# Altium schematic sheet BUS_LCD.SchDoc
size A4
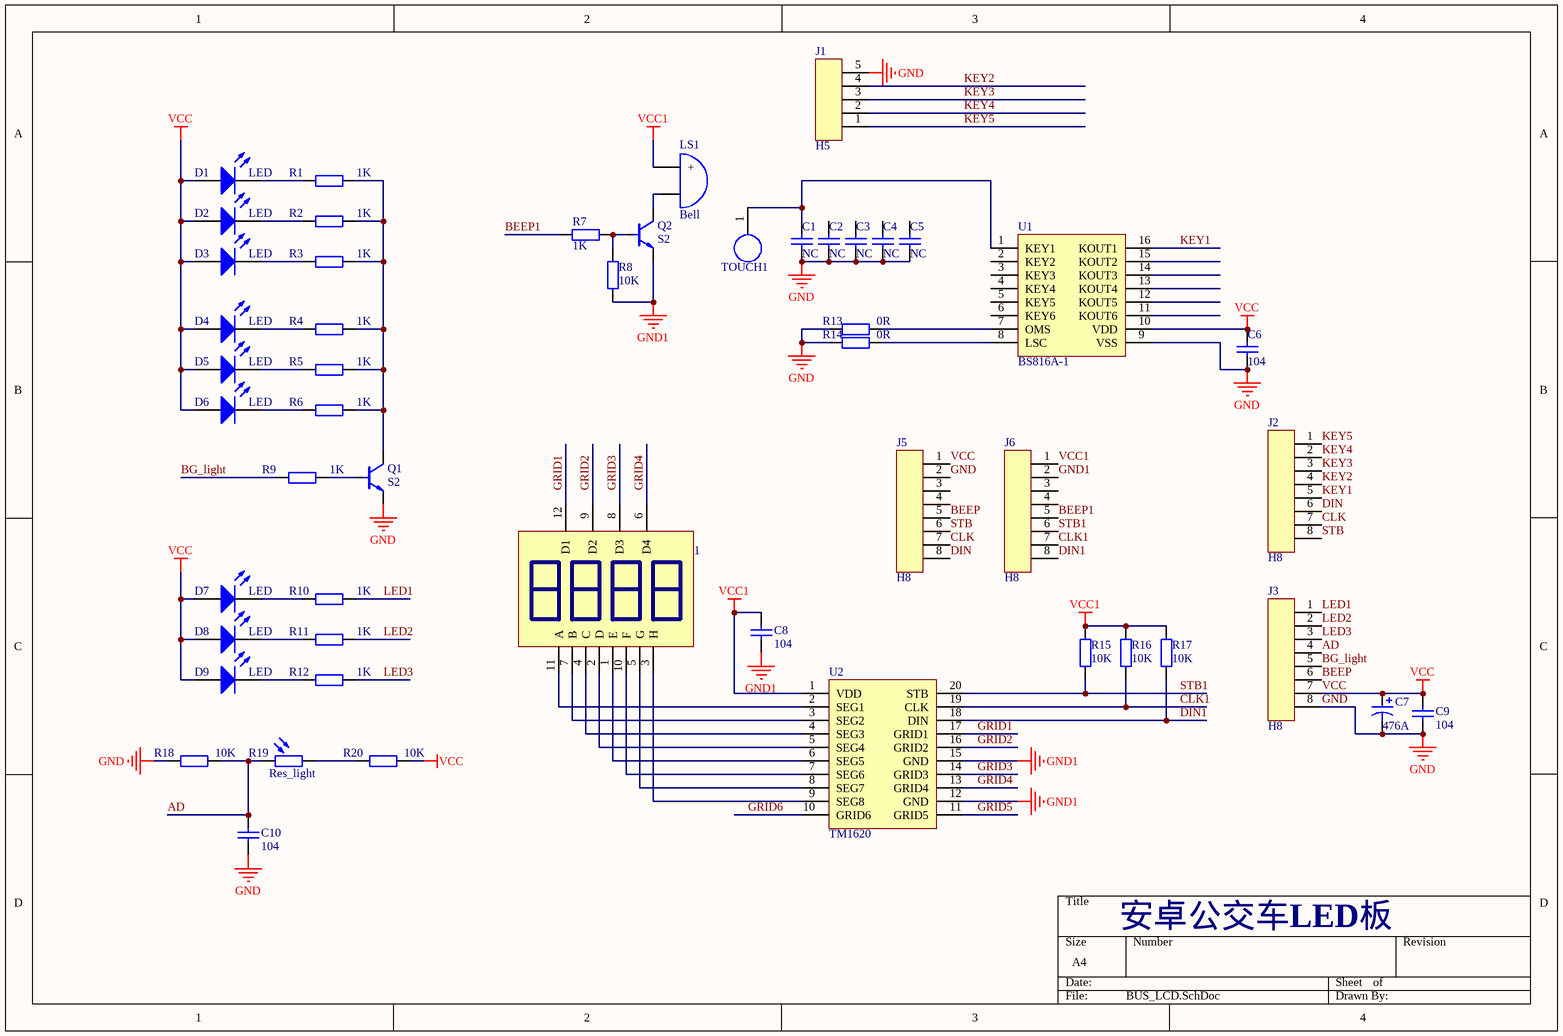
[diagram p0: BUS_LCD.SchDoc]

## Parts
1  7SEG-MPX4  [7SEG-MPX4-0.36]  (value not drawn)
C1  NC  [C0603]
C2  NC  [C0603]
C3  NC  [C0603]
C4  NC  [C0603]
C5  NC  [C0603]
C6  104  [C0603]
C7  476A  [476A]
C8  104  [C0603]
C9  104  [C0603]
C10  104  [C0603]
D1  LED  [LED0805-SMT]
D2  LED  [LED0805-SMT]
D3  LED  [LED0805-SMT]
D4  LED  [LED0805-SMT]
D5  LED  [LED0805-SMT]
D6  LED  [LED0805-SMT]
D7  LED  [LED0805-SMT]
D8  LED  [LED0805-SMT]
D9  LED  [LED0805-SMT]
J1  H5  [H5_2.54]
J2  H8  [1.25-8P-LT]
J3  H8  [1.25-8P-LT]
J5  H8  [1.25-8P-LT]
J6  H8  [1.25-8P-LT]
LS1  Bell  [Bell_12*9]
Q1  S2  [SOT-23]
Q2  S2  [SOT-23]
R1  1K  [R0603]
R2  1K  [R0603]
R3  1K  [R0603]
R4  1K  [R0603]
R5  1K  [R0603]
R6  1K  [R0603]
R7  1K  [0603R]
R8  10K  [0603R]
R9  1K  [R0603]
R10  1K  [R0603]
R11  1K  [R0603]
R12  1K  [R0603]
R13  0R  [R0603]
R14  0R  [R0603]
R15  10K  [R0603]
R16  10K  [R0603]
R17  10K  [R0603]
R18  10K  [R0603]
R19  Res_light  [LED0805-SMT]
R20  10K  [R0603]
TOUCH1  TouchKey1  [TOUCHKEY6]  (value not drawn)
U1  BS816A-1  [SO-16]
U2  TM1620  [SOJ-20]

## Nets
GND: C1.1 C2.1 C3.1 C4.1 C5.1 C6.1 C7.2 C9.1 C10.1 J1.5 J3.8 J5.2 Q1.1(e) R13.2 R14.2 R18.1 U1.9(VSS)
GND1: C8.1 J6.2 Q2.1(e) R8.1 U2.12(GND) U2.15(GND)
VCC: C6.2 C7.1 C9.2 D1.1(A) D2.1(A) D3.1(A) D4.1(A) D5.1(A) D6.1(A) D7.1(A) D8.1(A) D9.1(A) J3.7 J5.1 R20.2 U1.10(VDD)
VCC1: C8.2 J6.1 LS1.1(+) R15.2 R16.2 R17.2 U2.1(VDD)
AD: C10.2 J3.4 R18.2 R19.2
BEEP: J3.6 J5.5
BEEP1: J6.5 R7.1
BG_light: J3.5 R9.1
CLK: J2.7 J5.7
CLK1: J6.7 R16.1 U2.19(CLK)
DIN: J2.6 J5.8
DIN1: J6.8 R17.1 U2.18(DIN)
GRID1: 1.12(D1) U2.17(GRID1)
GRID2: 1.9(D2) U2.16(GRID2)
GRID3: 1.8(D3) U2.14(GRID3)
GRID4: 1.6(D4) U2.13(GRID4)
GRID5: U2.11(GRID5)
GRID6: U2.10(GRID6)
KEY1: J2.5 U1.16(KOUT1)
KEY2: J1.4 J2.4
KEY3: J1.3 J2.3
KEY4: J1.2 J2.2
KEY5: J1.1 J2.1
LED1: J3.1 R10.2
LED2: J3.2 R11.2
LED3: J3.3 R12.2
STB: J2.8 J5.6
STB1: J6.6 R15.1 U2.20(STB)
Net1_1: 1.1(E) U2.6(SEG5)
Net1_2: 1.2(D) U2.5(SEG4)
Net1_3: 1.3(H) U2.9(SEG8)
Net1_4: 1.4(C) U2.4(SEG3)
Net1_5: 1.5(G) U2.8(SEG7)
Net1_7: 1.7(B) U2.3(SEG2)
Net1_10: 1.10(F) U2.7(SEG6)
Net1_11: 1.11(A) U2.2(SEG1)
NetC1_2: C1.2 TOUCH1.1 U1.1(KEY1)
NetD1_2: D1.2(K) R1.1
NetD2_2: D2.2(K) R2.1
NetD3_2: D3.2(K) R3.1
NetD4_2: D4.2(K) R4.1
NetD5_2: D5.2(K) R5.1
NetD6_2: D6.2(K) R6.1
NetD7_2: D7.2(K) R10.1
NetD8_2: D8.2(K) R11.1
NetD9_2: D9.2(K) R12.1
NetLS1_2: LS1.2(-) Q2.3(c)
NetQ1_2: Q1.2(b) R9.2
NetQ1_3: Q1.3(c) R1.2 R2.2 R3.2 R4.2 R5.2 R6.2
NetQ2_2: Q2.2(b) R7.2 R8.2
NetR13_1: R13.1 U1.7(OMS)
NetR14_1: R14.1 U1.8(LSC)
NetR19_1: R19.1 R20.1

Not connected (* = marked no-connect by the designer): C2 2; C3 2; C4 2; C5 2; J5 3 4; J6 3 4; U1 2(KEY2) 3(KEY3) 4(KEY4) 5(KEY5) 6(KEY6) 11(KOUT6) 12(KOUT5) 13(KOUT4) 14(KOUT3) 15(KOUT2)

## Notes on the sheet
- 安卓公交车LED板

## Library data of the parts
C1-C5 = Cap: Capacitor; Value: 104; Published: 8-Jun-2000; LatestRevisionDate: 17-Jul-2002; LatestRevisionNote: Re-released for DXP Platform.; PackageReference: RAD-0.3; Publisher: Altium Limited
C6 C8-C10 = Cap: Capacitor; Published: 8-Jun-2000; LatestRevisionDate: 17-Jul-2002; LatestRevisionNote: Re-released for DXP Platform.; PackageReference: RAD-0.3; Publisher: Altium Limited; Value: 104
C7 = Cap Pol: Polarized Capacitor; Published: 8-Jun-2000; LatestRevisionDate: 17-Jul-2002; LatestRevisionNote: Re-released for DXP Platform.; PackageReference: RB7.6-15; Publisher: Altium Limited; Value: 476A
D1-D9 = LED: LED light
LS1 = Bell: Electrical Bell; Published: 24-Mar-1999; LatestRevisionDate: 17-Jul-2002; LatestRevisionNote: Re-released for DXP Platform.; PackageReference: PIN2; Publisher: Altium Limited
Q1 Q2 = NPN: NPN General Purpose Amplifier
R1-R18 R20 = Res: Resistor; Value: 4.7K; Published: 8-Jun-2000; LatestRevisionDate: 17-Jul-2002; LatestRevisionNote: Re-released for DXP Platform.; PackageReference: AXIAL-0.4; Publisher: Altium Limited
R19 = Res_light: Light Dependent Rsistors; Value: 4.7K; Published: 8-Jun-2000; LatestRevisionDate: 17-Jul-2002; LatestRevisionNote: Re-released for DXP Platform.; PackageReference: AXIAL-0.4; Publisher: Altium Limited
U2 = TM1620: 数码管驱动